# Altium schematic sheet conroller.SchDoc
size A; SheetNumber: 1; SheetTotal: 1
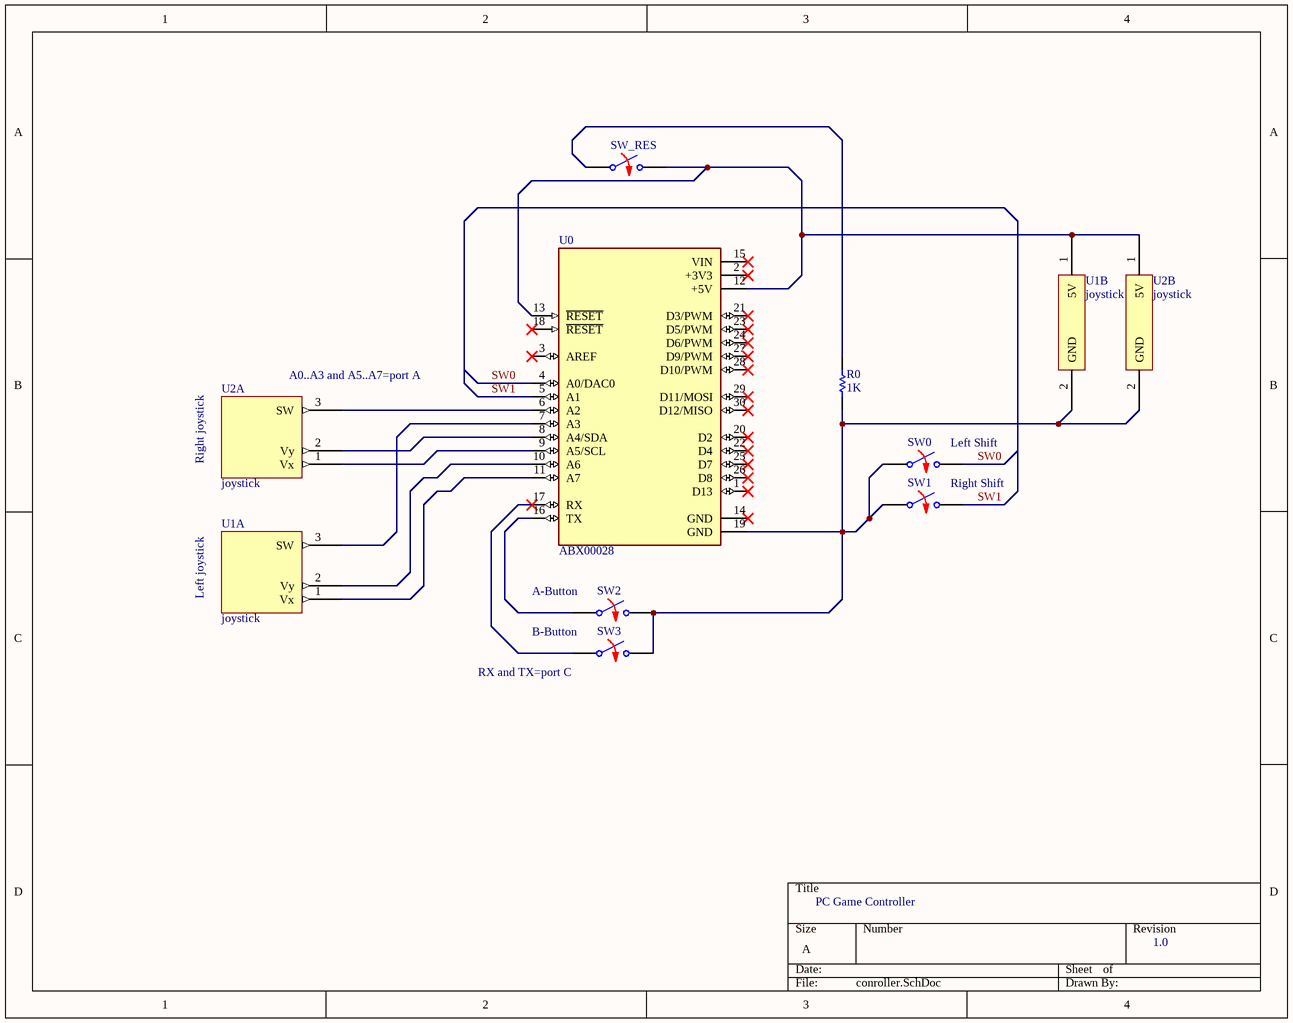
[diagram p0: conroller.SchDoc]

## Parts
R0  value 1K  (hidden comment: Resistor)
SW0  Switch Normally Opened  (value not drawn)
SW1  Switch Normally Opened  (value not drawn)
SW2  Switch Normally Opened  (value not drawn)
SW3  Switch Normally Opened  (value not drawn)
SW_RES  Switch Normally Opened  (value not drawn)
U0  ABX00028  [MODULE_ABX00028]
U1  joystick  (parts A,B of 2)
U2  joystick  (parts A,B of 2)

## Nets
SW0: SW0.2 U0.4(A0/DAC0)
SW1: SW1.2 U0.5(A1)
NetR0_1: R0.1 SW0.1 SW1.1 SW2.2 SW3.2 U0.19(GND) U1.2(GND) U2.2(GND)
NetR0_2: R0.2 SW_RES.1
NetSW2_1: SW2.1 U0.16(TX)
NetSW3_1: SW3.1 U0.17(RX)
NetSW_RES_2: SW_RES.2 U0.12(+5V) U0.13(~{RESET}) U1.1(5V) U2.1(5V)
NetU0_6: U0.6(A2) U2.3(SW)
NetU0_7: U0.7(A3) U1.3(SW)
NetU0_8: U0.8(A4/SDA) U2.2(Vy)
NetU0_9: U0.9(A5/SCL) U2.1(Vx)
NetU0_10: U0.10(A6) U1.2(Vy)
NetU0_11: U0.11(A7) U1.1(Vx)

Not connected (* = marked no-connect by the designer): U0 1(D13)* 2(+3V3)* 3(AREF)* 14(GND)* 15(VIN)* 18(~{RESET})* 20(D2)* 21(D3/PWM)* 22(D4)* 23(D5/PWM)* 24(D6/PWM)* 25(D7)* 26(D8)* 27(D9/PWM)* 28(D10/PWM)* 29(D11/MOSI)* 30(D12/MISO)*

## Notes on the sheet
- (near U2) A0..A3 and A5..A7=port A
- Right joystick
- Right Shift
- (near SW0) Left Shift
- Left joystick
- (near SW2) A-Button
- B-Button
- (near SW3) RX and TX=port C
- PC Game Controller
- 1.0

## Library data of the parts
R0 = Resistor: TC1: 0; SimulationGenericComponent: True; TC2: 0
SW0-SW3 SW_RES = SW NO: closed: 0; Rclosed: 1m; Ropen: 1Meg; SimulationGenericComponent: True
U0 = ABX00028: Arduinoâ€™s 5V compatible board in the smallest available form factor: 45x18mm!; MP: Arduino Nano Every; Check_prices: https://www.snapeda.com/parts/Arduino%20Nano%20Every/Arduino/view-part/?ref=eda; Value: *; Availability: Not in stock; Price: None; Package: None; SnapEDA_Link: https://www.snapeda.com/parts/Arduino%20Nano%20Every/Arduino/view-part/?ref=snap; MF: Arduino